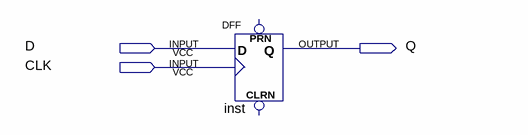
[diagram p0: schematic sheet]
// Quartus schematic DFF_test.bdf as structural Verilog: 1 symbols, 3 pins
module DFF_test (
  input  D,
  input  CLK,
  output Q
);

  DFF inst (.CLK(CLK), .D(D), .Q(Q));  // open: CLRN, PRN
endmodule
